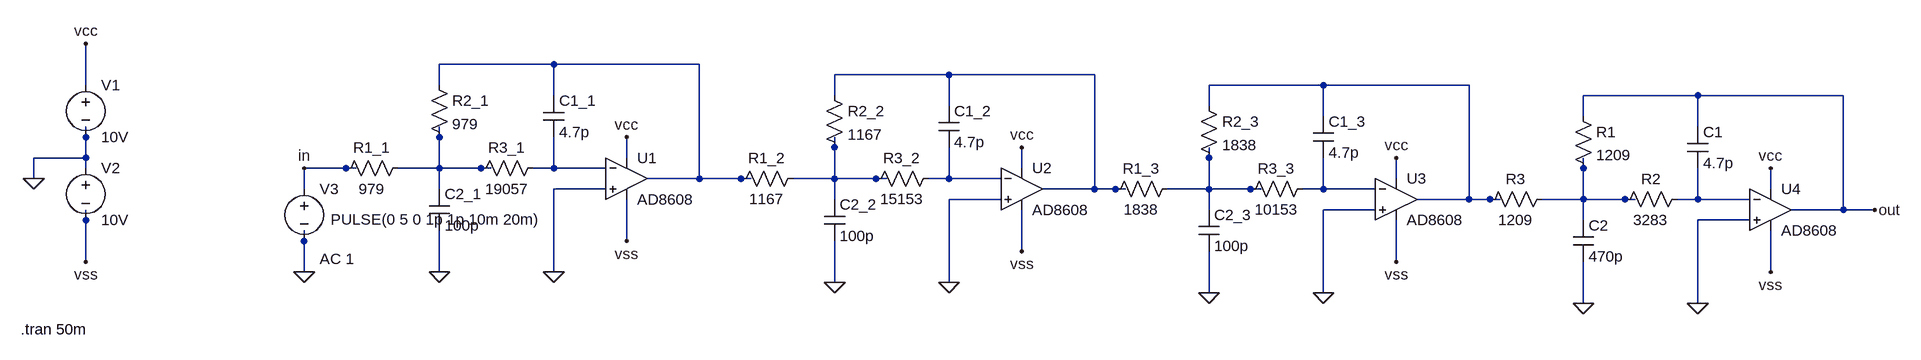
[diagram p0: schematic AAF_8Ord.asc]
AAF_8Ord.asc, the LTspice schematic file:
Version 4
SHEET 1 2616 680
WIRE 416 48 240 48
WIRE 640 48 416 48
WIRE 1024 64 848 64
WIRE 1248 64 1024 64
WIRE -304 80 -304 16
WIRE 240 80 240 48
WIRE 1600 80 1424 80
WIRE 1824 80 1600 80
WIRE 416 96 416 48
WIRE 848 96 848 64
WIRE 2176 96 2000 96
WIRE 2400 96 2176 96
WIRE 1024 112 1024 64
WIRE 1424 112 1424 80
WIRE 1600 128 1600 80
WIRE 2000 128 2000 96
WIRE 2176 144 2176 96
WIRE -304 192 -304 144
WIRE -304 192 -384 192
WIRE 528 192 528 160
WIRE -304 208 -304 192
WIRE 112 208 32 208
WIRE 240 208 240 144
WIRE 240 208 176 208
WIRE 320 208 240 208
WIRE 416 208 416 160
WIRE 416 208 384 208
WIRE 496 208 416 208
WIRE 1136 208 1136 176
WIRE -384 224 -384 192
WIRE 640 224 640 48
WIRE 640 224 560 224
WIRE 720 224 640 224
WIRE 848 224 848 160
WIRE 848 224 784 224
WIRE 928 224 848 224
WIRE 1024 224 1024 176
WIRE 1024 224 992 224
WIRE 1104 224 1024 224
WIRE 1712 224 1712 192
WIRE 32 240 32 208
WIRE 240 240 240 208
WIRE 496 240 416 240
WIRE 1248 240 1248 64
WIRE 1248 240 1168 240
WIRE 1296 240 1248 240
WIRE 1424 240 1424 176
WIRE 1424 240 1360 240
WIRE 1504 240 1424 240
WIRE 1600 240 1600 192
WIRE 1600 240 1568 240
WIRE 1680 240 1600 240
WIRE 2288 240 2288 208
WIRE 848 256 848 224
WIRE 1104 256 1024 256
WIRE 1824 256 1824 80
WIRE 1824 256 1744 256
WIRE 1872 256 1824 256
WIRE 2000 256 2000 192
WIRE 2000 256 1936 256
WIRE 2080 256 2000 256
WIRE 2176 256 2176 208
WIRE 2176 256 2144 256
WIRE 2256 256 2176 256
WIRE 1424 272 1424 240
WIRE 1680 272 1600 272
WIRE 2400 272 2400 96
WIRE 2400 272 2320 272
WIRE 2448 272 2400 272
WIRE 2000 288 2000 256
WIRE 2256 288 2176 288
WIRE 528 320 528 256
WIRE 1136 336 1136 272
WIRE -304 352 -304 272
WIRE 1712 352 1712 288
WIRE 32 368 32 304
WIRE 240 368 240 304
WIRE 416 368 416 240
WIRE 2288 368 2288 304
WIRE 848 384 848 320
WIRE 1024 384 1024 256
WIRE 1424 400 1424 336
WIRE 1600 400 1600 272
WIRE 2000 416 2000 352
WIRE 2176 416 2176 288
FLAG -304 16 vcc
FLAG -304 352 vss
FLAG -384 224 0
FLAG 416 368 0
FLAG 240 368 0
FLAG 528 320 vss
FLAG 528 160 vcc
FLAG 1024 384 0
FLAG 848 384 0
FLAG 1136 336 vss
FLAG 1136 176 vcc
FLAG 1600 400 0
FLAG 1424 400 0
FLAG 1712 352 vss
FLAG 1712 192 vcc
FLAG 2448 272 out
FLAG 32 368 0
FLAG 32 208 in
FLAG 2176 416 0
FLAG 2000 416 0
FLAG 2288 368 vss
FLAG 2288 208 vcc
SYMBOL voltage -304 64 R0
WINDOW 123 0 0 Left 0
WINDOW 39 0 0 Left 0
SYMATTR InstName V1
SYMATTR Value 10V
SYMBOL voltage -304 192 R0
WINDOW 123 0 0 Left 0
WINDOW 39 0 0 Left 0
SYMATTR InstName V2
SYMATTR Value 10V
SYMBOL cap 400 96 R0
SYMATTR InstName C1_1
SYMATTR Value 4.7p
SYMBOL cap 224 240 R0
SYMATTR InstName C2_1
SYMATTR Value 100p
SYMBOL res 224 64 R0
SYMATTR InstName R2_1
SYMATTR Value 979
SYMBOL res 400 192 R90
WINDOW 0 0 56 VBottom 2
WINDOW 3 32 56 VTop 2
SYMATTR InstName R3_1
SYMATTR Value 19057
SYMBOL res 192 192 R90
WINDOW 0 0 56 VBottom 2
WINDOW 3 32 56 VTop 2
SYMATTR InstName R1_1
SYMATTR Value 979
SYMBOL cap 1008 112 R0
SYMATTR InstName C1_2
SYMATTR Value 4.7p
SYMBOL cap 832 256 R0
SYMATTR InstName C2_2
SYMATTR Value 100p
SYMBOL res 832 80 R0
SYMATTR InstName R2_2
SYMATTR Value 1167
SYMBOL res 1008 208 R90
WINDOW 0 0 56 VBottom 2
WINDOW 3 32 56 VTop 2
SYMATTR InstName R3_2
SYMATTR Value 15153
SYMBOL res 800 208 R90
WINDOW 0 0 56 VBottom 2
WINDOW 3 32 56 VTop 2
SYMATTR InstName R1_2
SYMATTR Value 1167
SYMBOL cap 1584 128 R0
SYMATTR InstName C1_3
SYMATTR Value 4.7p
SYMBOL cap 1408 272 R0
SYMATTR InstName C2_3
SYMATTR Value 100p
SYMBOL res 1408 96 R0
SYMATTR InstName R2_3
SYMATTR Value 1838
SYMBOL res 1584 224 R90
WINDOW 0 0 56 VBottom 2
WINDOW 3 32 56 VTop 2
SYMATTR InstName R3_3
SYMATTR Value 10153
SYMBOL res 1376 224 R90
WINDOW 0 0 56 VBottom 2
WINDOW 3 32 56 VTop 2
SYMATTR InstName R1_3
SYMATTR Value 1838
SYMBOL voltage 32 224 R0
WINDOW 123 24 124 Left 2
WINDOW 39 0 0 Left 0
WINDOW 3 41 63 Left 2
SYMATTR Value2 AC 1
SYMATTR Value PULSE(0 5 0 1p 1p 10m 20m)
SYMATTR InstName V3
SYMBOL Opamps\\AD8608 528 160 R0
SYMATTR InstName U1
SYMBOL Opamps\\AD8608 1136 176 R0
SYMATTR InstName U2
SYMBOL Opamps\\AD8608 1712 192 R0
SYMATTR InstName U3
SYMBOL cap 2160 144 R0
SYMATTR InstName C1
SYMATTR Value 4.7p
SYMBOL cap 1984 288 R0
SYMATTR InstName C2
SYMATTR Value 470p
SYMBOL res 1984 112 R0
SYMATTR InstName R1
SYMATTR Value 1209
SYMBOL res 2160 240 R90
WINDOW 0 0 56 VBottom 2
WINDOW 3 32 56 VTop 2
SYMATTR InstName R2
SYMATTR Value 3283
SYMBOL res 1952 240 R90
WINDOW 0 0 56 VBottom 2
WINDOW 3 32 56 VTop 2
SYMATTR InstName R3
SYMATTR Value 1209
SYMBOL Opamps\\AD8608 2288 208 R0
SYMATTR InstName U4
TEXT -404 456 Left 2 !.tran 50m

The netlist it stands for:
* AAF_8Ord.asc
V1 vcc 0 10V
V2 0 vss 10V
C1_1 N001 N005 4.7p
C2_1 N004 0 100p
R2_1 N001 N004 979
R3_1 N005 N004 19057
R1_1 N004 in 979
C1_2 N002 N007 4.7p
C2_2 N006 0 100p
R2_2 N002 N006 1167
R3_2 N007 N006 15153
R1_2 N006 N001 1167
C1_3 N003 N009 4.7p
C2_3 N008 0 100p
R2_3 N003 N008 1838
R3_3 N009 N008 10153
R1_3 N008 N002 1838
V3 in 0 PULSE(0 5 0 1p 1p 10m 20m) AC 1
XU1 0 N005 vcc vss N001 AD8608  ; pins In+ In- V+ V- OUT
XU2 0 N007 vcc vss N002 AD8608  ; pins In+ In- V+ V- OUT
XU3 0 N009 vcc vss N003 AD8608  ; pins In+ In- V+ V- OUT
C1 out N011 4.7p
C2 N010 0 470p
R1 out N010 1209
R2 N011 N010 3283
R3 N010 N003 1209
XU4 0 N011 vcc vss out AD8608  ; pins In+ In- V+ V- OUT
.tran 50m
.backanno
.end